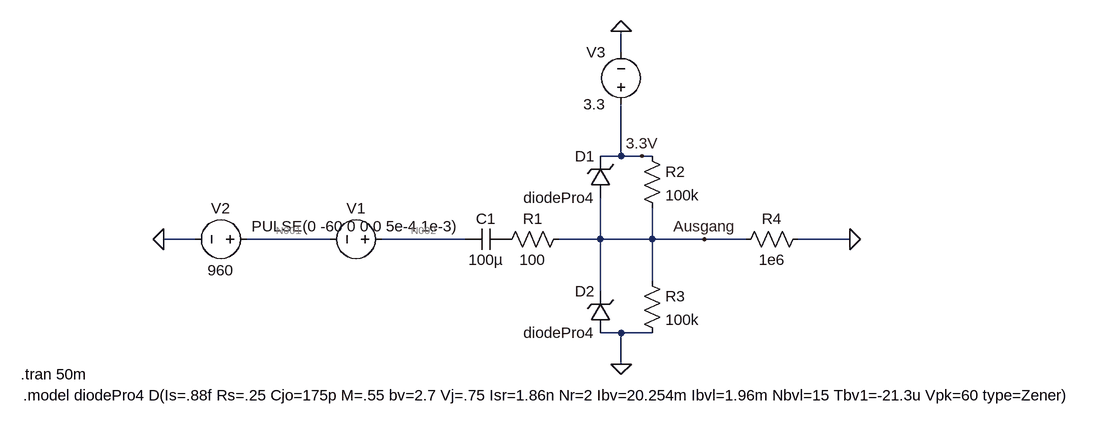
[diagram p0: schematic receiver_master.asc]
receiver_master.asc, the LTspice schematic file:
Version 4
SHEET 1 1372 680
WIRE 224 -128 224 -160
WIRE 224 32 224 -48
WIRE 224 32 192 32
WIRE 256 32 224 32
WIRE 272 32 256 32
WIRE -432 160 -480 160
WIRE -224 160 -352 160
WIRE -16 160 -144 160
WIRE 192 160 192 96
WIRE 192 160 128 160
WIRE 272 160 272 112
WIRE 272 160 192 160
WIRE 352 160 272 160
WIRE 416 160 352 160
WIRE 576 160 496 160
WIRE 272 224 272 160
WIRE 192 240 192 160
WIRE 224 304 192 304
WIRE 272 304 224 304
WIRE 224 352 224 304
FLAG 576 160 0
FLAG -480 160 0
FLAG 352 160 Ausgang
FLAG 224 352 0
FLAG 256 32 3.3V
FLAG 224 -160 0
SYMBOL cap 48 144 R90
WINDOW 0 0 32 VBottom 2
WINDOW 3 32 32 VTop 2
SYMATTR InstName C1
SYMATTR Value 100µ
SYMBOL res 144 144 R90
WINDOW 0 0 56 VBottom 2
WINDOW 3 32 56 VTop 2
SYMATTR InstName R1
SYMATTR Value 100
SYMBOL zener 208 96 R180
WINDOW 0 24 64 Left 2
WINDOW 3 24 0 Left 2
SYMATTR InstName D1
SYMATTR Value diodePro4
SYMATTR Description Diode
SYMATTR Type diode
SYMBOL zener 208 304 R180
WINDOW 0 24 64 Left 2
WINDOW 3 24 0 Left 2
SYMATTR InstName D2
SYMATTR Value diodePro4
SYMATTR Description Diode
SYMATTR Type diode
SYMBOL res 256 16 R0
SYMATTR InstName R2
SYMATTR Value 100k
SYMBOL res 256 208 R0
SYMATTR InstName R3
SYMATTR Value 100k
SYMBOL res 512 144 R90
WINDOW 0 0 56 VBottom 2
WINDOW 3 32 56 VTop 2
SYMATTR InstName R4
SYMATTR Value 1e6
SYMBOL voltage -128 160 R90
WINDOW 0 -32 56 VBottom 2
WINDOW 3 -4 56 VBottom 2
WINDOW 123 60 56 VTop 2
WINDOW 39 0 0 Left 2
SYMATTR InstName V1
SYMATTR Value PULSE(0 -60 0 0 0 5e-4 1e-3)
SYMBOL voltage -336 160 R90
WINDOW 0 -32 56 VBottom 2
WINDOW 3 32 56 VTop 2
WINDOW 123 0 0 Left 2
WINDOW 39 0 0 Left 2
SYMATTR InstName V2
SYMATTR Value 960
SYMBOL voltage 224 -32 R180
WINDOW 0 24 96 Left 2
WINDOW 3 24 16 Left 2
WINDOW 123 0 0 Left 2
WINDOW 39 0 0 Left 2
SYMATTR InstName V3
SYMATTR Value 3.3
TEXT -700 368 Left 2 !.tran 50m
TEXT -696 400 Left 2 !.model diodePro4 D(Is=.88f Rs=.25 Cjo=175p M=.55 bv=2.7 Vj=.75 Isr=1.86n Nr=2 Ibv=20.254m Ibvl=1.96m Nbvl=15 Tbv1=-21.3u Vpk=60 type=Zener)

The netlist it stands for:
* receiver_master.asc
C1 P001 N002 100µ
R1 Ausgang P001 100
D1 Ausgang 3.3V diodePro4
D2 0 Ausgang diodePro4
R2 3.3V Ausgang 100k
R3 Ausgang 0 100k
R4 0 Ausgang 1e6
V1 N002 N001 PULSE(0 -60 0 0 0 5e-4 1e-3)
V2 N001 0 960
V3 3.3V 0 3.3
.model D D
.lib standard.dio
.tran 50m
.model diodePro4 D(Is=.88f Rs=.25 Cjo=175p M=.55 bv=2.7 Vj=.75 Isr=1.86n Nr=2 Ibv=20.254m Ibvl=1.96m Nbvl=15 Tbv1=-21.3u Vpk=60 type=Zener)
.backanno
.end

* Results of the author's LTspice run, read from the files saved beside the schematic
* Operating Point, zero values left out:
*   V(p001) = 1.648 V
*   V(n002) = 960 V
*   V(ausgang) = 1.648 V
*   V(3.3v) = 3.3 V
*   V(n001) = 960 V
*   I(D2) = -128.2 µA
*   I(D1) = -129.8 µA
*   I(R4) = -1.648 µA
*   I(R3) = 16.48 µA
*   I(R2) = 16.52 µA
*   I(V3) = -146.3 µA
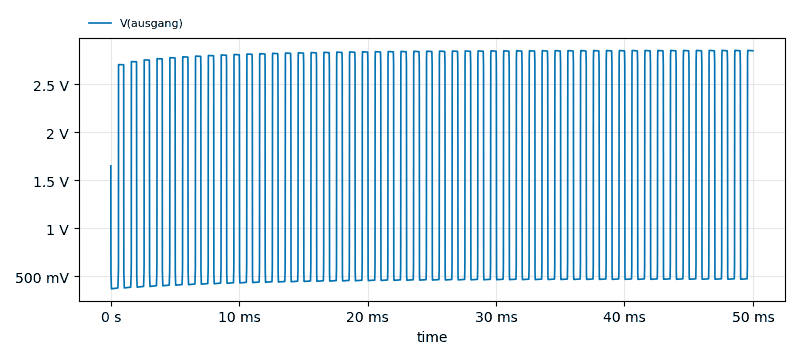
[diagram p1: Transient Analysis of receiver_master.asc, plotted from the saved traces]
* Transient Analysis, 1 run:
*   V(ausgang): min 366.7 mV, max 2.852 V, average 1.505 V, rms 1.909 V, last 2.847 V